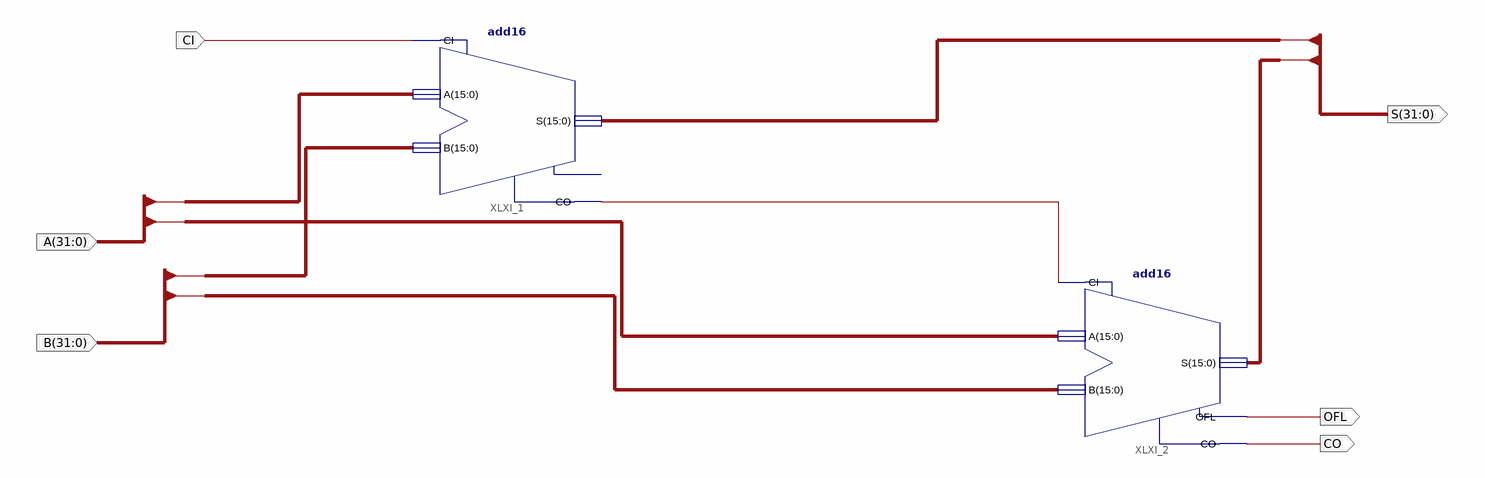
[diagram p0: schematic sheet 1]
// Xilinx ISE schematic add_32b.sch (spartan3) as structural Verilog: 2 symbols, 6 ports
module add_32b (
  input  [31:0] A,
  input  [31:0] B,
  input  CI,
  output OFL,
  output CO,
  output [31:0] S
);

  wire XLXN_12;

  add16 XLXI_1 (.A(A[15:0]), .B(B[15:0]), .CI(CI), .CO(XLXN_12), .S(S[15:0]));  // open: OFL
  add16 XLXI_2 (.A(A[31:16]), .B(B[31:16]), .CI(XLXN_12), .CO(CO), .OFL(OFL), .S(S[31:16]));
endmodule
